# EAGLE design ATTiny5 (EAGLE 6.4)
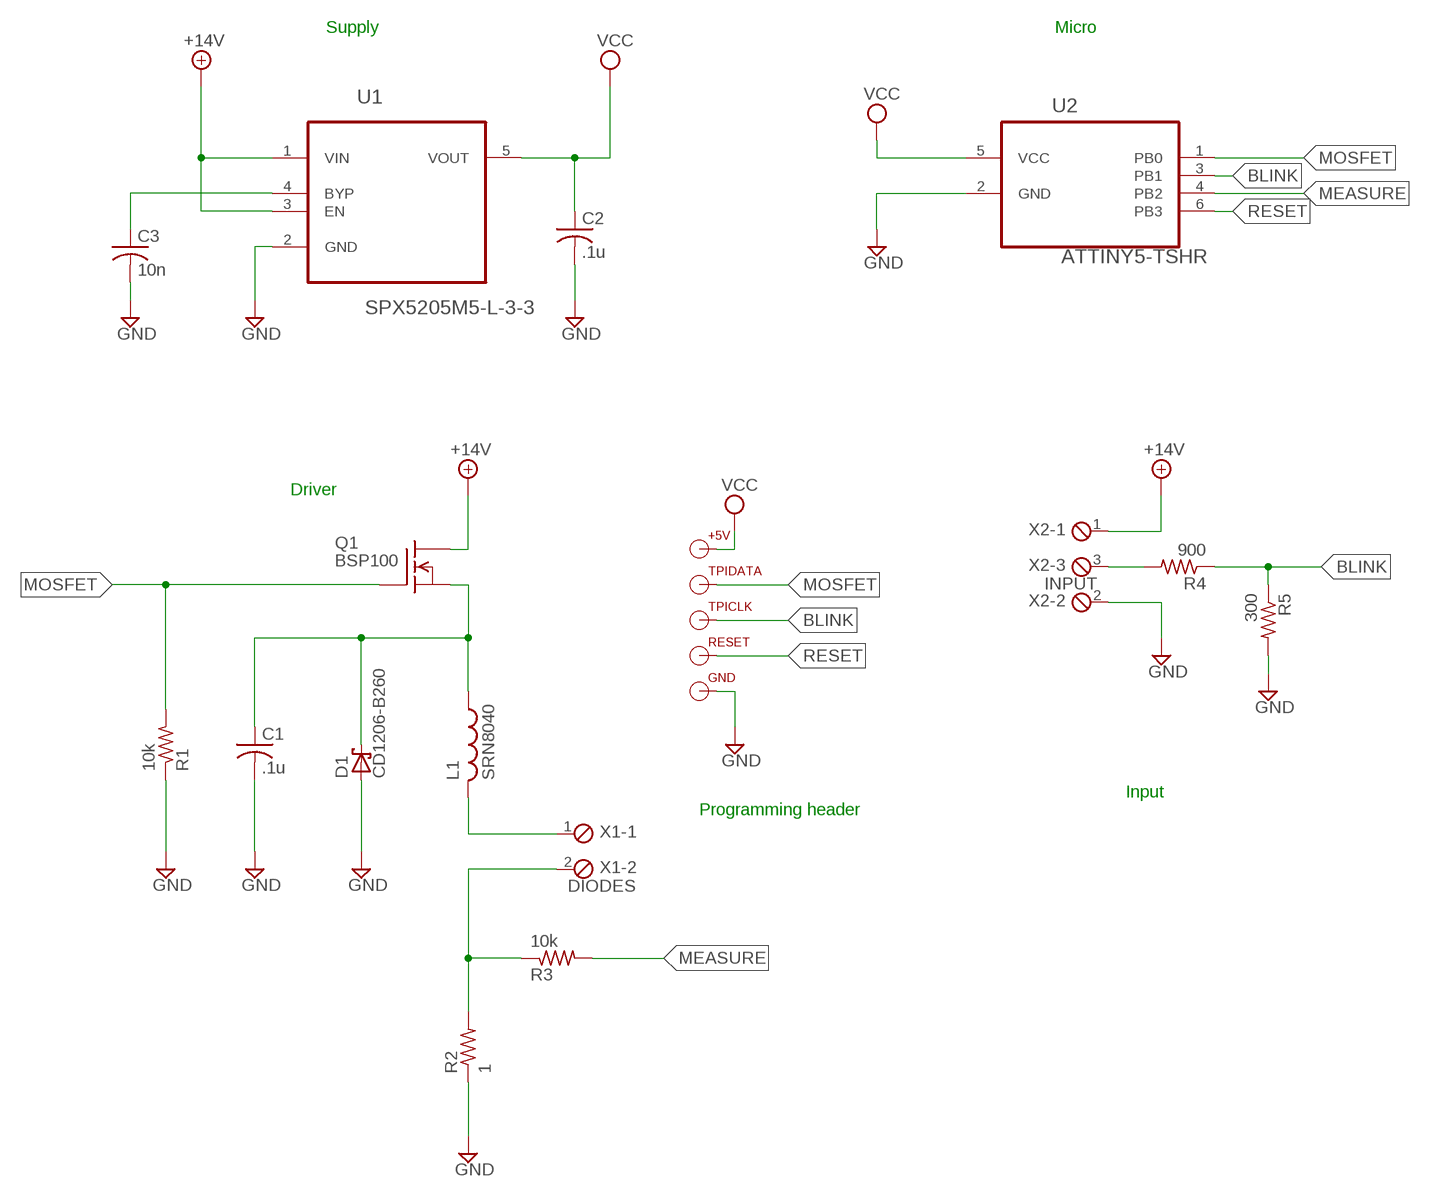
[diagram p0: schematic, sheet 1]

## Parts
+5V  TPI  [TPI_PAD]
C1  .1u  C-USC0805  [C0805]
C2  .1u  C-USC0805  [C0805]
C3  10n  C-USC0603  [C0603]
D1  CD1206-B260  [D1206]
GND  TPI  [TPI_PAD]
L1  SRN8040  [SRN8040]
Q1  BSP100  [SOT223]
R1  10k  R-US_R1206  [R1206]
R2  1  R-US_R1206  [R1206]
R3  10k  R-US_R1206  [R1206]
R4  900  R-US_R1206  [R1206]
R5  300  R-US_R1206  [R1206]
RESET  TPI  [TPI_PAD]
TPICLK  TPI  [TPI_PAD]
TPIDATA  TPI  [TPI_PAD]
U1  SPX5205M5-L-3-3  [SOT95P280X145-5N]
U2  ATTINY5-TSHR  [SOT95P280X145-6N]
X1  DIODES  MPT2  [2POL254]
X2  INPUT  MPT3  [3POL254]

## Nets
+14V: Q1.2(D) Q1.TAB(D) U1.1(VIN) U1.3(EN) X2.1
BLINK: R4.1 R5.1 TPICLK.P$1(TPI_PIN) U2.3(PB1)
D-: R2.2 R3.1 X1.2
GND: C1.2 C2.2 C3.2 D1.2(A) GND.P$1(TPI_PIN) R1.1 R2.1 R5.2 U1.2(GND) U2.2(GND) X2.2
L+: C1.1 D1.1(C) L1.P$1 Q1.3(S)
MEASURE: R3.2 U2.4(PB2)
MOSFET: Q1.1(G) R1.2 TPIDATA.P$1(TPI_PIN) U2.1(PB0)
N$1: R4.2 X2.3
N$2: C3.1 U1.4(BYP)
N$3: L1.P$2 X1.1
RESET: RESET.P$1(TPI_PIN) U2.6(PB3)
VCC: +5V.P$1(TPI_PIN) C2.1 U1.5(VOUT) U2.5(VCC)

## Notes on the sheet
- Supply | Micro
- Driver
- Input
- Programming header

## Library data of the parts
+5V GND RESET TPICLK TPIDATA = Personal:TPI
C1-C3 = resistor:C-US: CAPACITOR, American symbol
D1 = Personal:CD1206-B260: CD1206-B260 Schottky Diode 60V 2A 1206
L1 = Personal:SRN8040
Q1 = Personal:BSP100
R1-R5 = resistor:R-US_: RESISTOR, American symbol
U1 = Exar_By_element14_Batch_1:SPX5205M5-L-3-3: 150mA, LOW-NOISE LDO VOLTAGE REGULATOR; MPN: SPX5205M5-L-3-3; OC_FARNELL: 1831954; OC_NEWARK: 23R9851; PACKAGE: SOT-23-5; SUPPLIER: EXAR
U2 = Atmel_By_element14_Batch_1:ATTINY5-TSHR: Microcontroller; DESCRIPTION: Microcontroller; MPN: ATTINY5-TSHR; OC_FARNELL: 1841626; OC_NEWARK: 12T1342; PACKAGE: SOT563-6; SUPPLIER: ATMEL
X1 = con-phoenix-254:MPT2: PHOENIX CONNECTOR; OC_FARNELL: unknown; OC_NEWARK: unknown
X2 = con-phoenix-254:MPT3: PHOENIX CONNECTOR; OC_FARNELL: unknown; OC_NEWARK: unknown

## Board
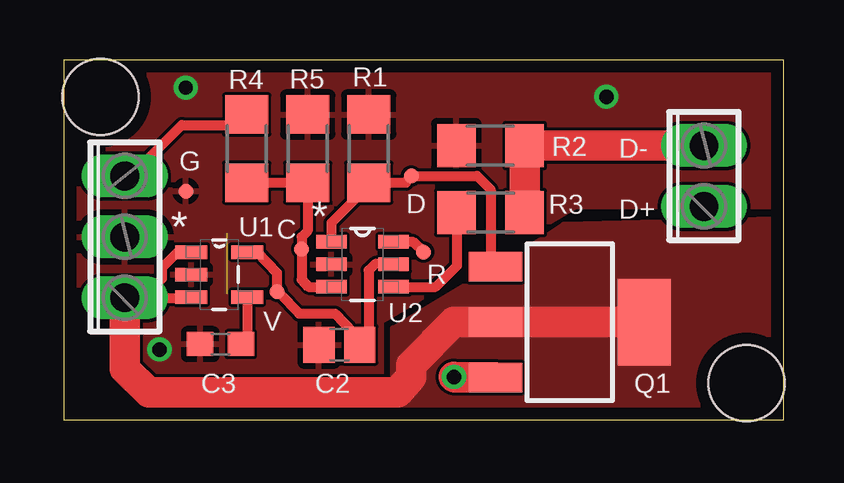
[diagram p1: board, top side]
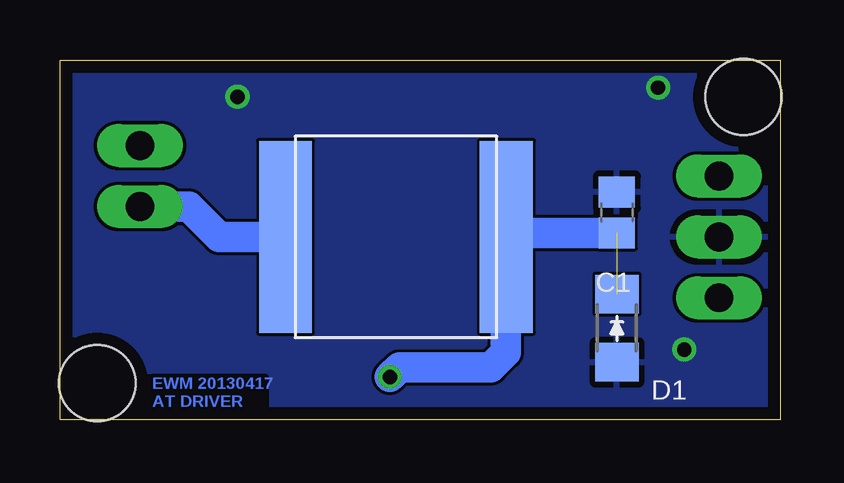
[diagram p2: board, bottom side, seen from below]

Size 30 x 15 mm. Coordinates in mm from the lower left corner, seen from the top.
Outline: 0,0 30,0 30,15 0,15 0,0
Copper layers (1*16): Top 0.035mm / dielectric 1.5mm / Bottom 0.035mm
Design rules "default *": minimum track width 10mil, minimum drill 10mil, track to track 5mil, track to pad 5mil, pad to pad 5mil, via to via 5mil, smd to smd 0mil, copper to edge 20mil, drill to drill 5mil, minimum pad ring 10mil, minimum via ring 8mil, stop-mask expansion 4mil, vias tented up to drill 0mil, thermal gap 10mil
Holes 3.17 mm at 1.52,13.46 28.45,1.52

### Footprints (pad centres in the part's own frame; a part is rotated, then mirrored left to right if it is on the bottom)
TPI_PAD = smd 0.635 x 0.635: P$1 0,0
C0805 = smd 1.3 x 1.5: 1 -0.85,0; 2 0.85,0
C0603 = smd 1.1 x 1: 1 -0.85,0; 2 0.85,0
D1206 = smd 1.6 x 1.803: 1 -1.422,0; 2 1.422,0
SRN8040 = smd 2.2 x 8: P$1 -4.6,0; P$2 4.6,0
SOT223 = smd 1.219 x 2.235: 1 -2.311,-3.099; 2 0,-3.099; 3 2.311,-3.099 | smd 3.6 x 2.2: TAB 0,3.099
R1206 = smd 1.6 x 1.803: 1 -1.422,0; 2 1.422,0
SOT95P280X145-5N = smd 1.321 x 0.559: 1 -1.168,0.94; 2 -1.168,0; 3 -1.168,-0.94; 4 1.168,-0.94; 5 1.168,0.94
SOT95P280X145-6N = smd 1.27 x 0.559: 1 -1.295,0.94; 2 -1.295,0; 3 -1.295,-0.94; 4 1.295,-0.94; 5 1.295,0; 6 1.295,0.94
2POL254 = drill 1.2 long: 1 -1.27,0; 2 1.27,0
3POL254 = drill 1.2 long: 1 -2.54,0; 2 0,0; 3 2.54,0

### Placement (x,y rotation side)
+5V  8.89,5.33 0 top
C1  6.8,8.64 90 bottom
C2  11.48,3.12 180 top
C3  6.53,3.15 180 top
D1  6.8,3.81 270 bottom
GND  5.08,9.53 0 top
L1  16,7.62 180 bottom
Q1  21.08,4.06 270 top
R1  12.7,11.3 270 top
R2  17.78,11.43 0 top
R3  17.78,8.64 180 top
R4  7.62,11.3 90 top
R5  10.16,11.3 90 top
RESET  14.99,6.99 0 top
TPICLK  9.91,7.11 0 top
TPIDATA  14.48,10.16 0 top
U1  6.48,6.05 0 top
U2  12.45,6.48 0 top
X1  26.67,10.16 90 top
X2  2.54,7.62 90 top

### Tracks (layer width: path | path; a pad name or v marks a point on that pad's centre or on a via)
+14V
  Top 0.406: X2.1 3.3,5.08 | 3.3,5.08 5.28,5.08 U1.3 | U1.1 4.75,6.99 4.09,6.33 4.09,5.87 3.3,5.08
  Top 1.27: X2.1 2.54,2.11 3.53,1.14 13.92,1.14 14.48,1.78 14.48,2.29 16.26,4.06 Q1.2 Q1.TAB
  pour Top: 13.72,3.81 20.07,7.62 20.83,8.13 30.48,8.38 30.48,-0.76 13.72,-0.76
BLINK
  Top 0.406: R4.1 R5.1 10.16,7.87 9.91,7.62 TPICLK.P$1 9.91,5.84 10.19,5.54 U2.3
D-
  Top 1.27: X1.2 R2.2 R3.1
GND  (via drill 0.6)
  other vias: 3.99,2.92 5.08,13.84 22.61,13.46
  pour Top: -1.52,16.51 30.48,16.51 30.48,8.89 21.34,8.89 13.21,4.06 13.21,-0.76 -1.27,-1.02
  pour Bottom: -0.77,15.5 30.3,15.5 30.25,-0.43 -0.73,-0.53
L+  (via drill 0.6)  (1 unrouted)
  Top 1.27: Q1.3 16.28,1.75 v16.26,1.78
  Bottom 1.27: v16.26,1.78 15.85,2.18 12.04,2.18 11.43,2.79 11.43,7.59 L1.P$1 11.24,7.79 C1.1
MEASURE
  Top 0.406: U2.4 15.49,5.54 16.38,6.43 16.38,8.61 R3.2
MOSFET
  Top 0.406: U2.1 11.15,8.2 12.7,9.75 R1.2 14.26,9.88 TPIDATA.P$1 17.22,10.16 17.78,9.6 17.78,6.58 Q1.1
N$1
  Top 0.406: X2.3 2.79,10.16 4.92,12.28 7.62,12.28 R4.2
N$2
  Top 0.406: 7.52,2.86 C3.1 7.64,3.42 U1.4
N$3
  Bottom 1.27: X1.1 24.64,8.89 23.37,7.62 L1.P$2
RESET
  Top 0.406: U2.6 14.53,7.42 RESET.P$1
VCC
  Top 0.406: U2.5 13.01,6.5 12.7,6.22 12.7,3.21 C2.1 12.06,3.39 12.06,3.63 11.3,4.42 9.8,4.42 8.97,5.28 +5V.P$1 8.89,6.12 8.05,6.99 U1.5

### Text on the board
Bottom: EWM 20130417 / AT DRIVER
tNames: D- | G | D | C | D+ | R | V